# Altium schematic sheet PowerManagement.SchDoc: Power Management
size A4; Author: Grzegorz Gajoch; DocumentNumber: 3; SheetNumber: 3; SheetTotal: 16; Model: EM1; PageSetup: Record=PageOptions|CenterHorizontal=True|CenterVertical=True|PrintScale=0.52|XCorrection=1.00|YCorrection=1.00|PrintKind=1|BorderSize=5000000|LeftOffset=0|BottomOffset=0|Orientation=2|PaperLength=4200|PaperWidth=2970|Scale=100|PaperSource=7|PrintQuality=600|MediaType=1|DitherType=10|PaperKind=A3|PrintScaleMode=1
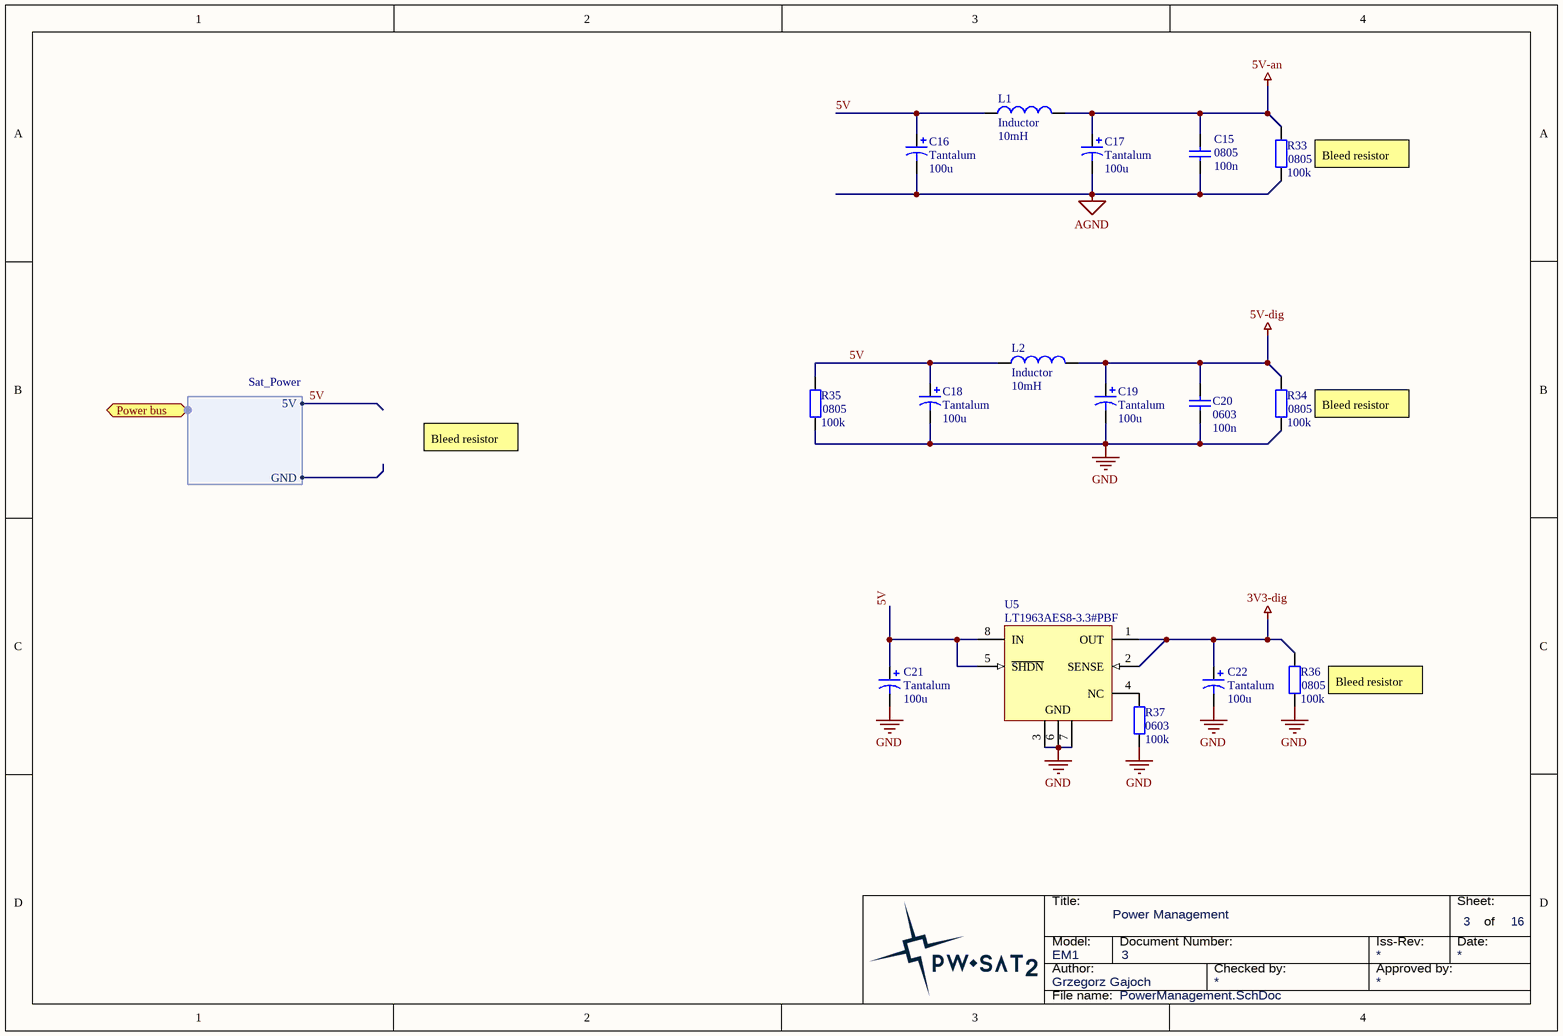
[diagram p0: PowerManagement.SchDoc]

## Parts
C15  0805  value 100n  [SMD_Capacitor_0805]
C16  Tantalum  value 100u  [Tantalum_cap_D]
C17  Tantalum  value 100u  [Tantalum_cap_D]
C18  Tantalum  value 100u  [Tantalum_cap_D]
C19  Tantalum  value 100u  [Tantalum_cap_D]
C20  0603  value 100n  [SMD_Capacitor_0603]
C21  Tantalum  value 100u  [Tantalum_cap_D]
C22  Tantalum  value 100u  [Tantalum_cap_D]
L1  Inductor  value 10mH  [SMD_Capacitor_0805]
L2  Inductor  value 10mH  [SMD_Capacitor_0805]
R33  0805  value 100k  [SMD_Resistor_0805]
R34  0805  value 100k  [SMD_Resistor_0805]
R35  0805  value 100k  [SMD_Resistor_0805]
R36  0805  value 100k  [SMD_Resistor_0805]
R37  0603  value 100k  [SMD_Resistor_0603]
U5  LT1963AES8-3.3#PBF  [LT-S8-8_N]

## Ports
Power bus (harness Sat_Power)

## Harnesses
Sat_Power: 5V, GND

## Nets
3V3-dig: C22.1 R36.2 U5.1(OUT) U5.2(SENSE)
5V-an: C15.2 C17.1 L1.2 R33.2
5V-dig: C19.1 C20.2 L2.2 R34.2
AGND: C15.1 C16.2 C17.2 R33.1
GND: C18.2 C19.2 C20.1 C21.2 C22.2 R34.1 R35.1 R36.1 R37.1 U5.3(GND) U5.6(GND) U5.7(GND)
5V: C16.1 C18.1 C21.1 L1.1 L2.1 R35.2 U5.5(~{SHDN}) U5.8(IN) ; port Power bus.5V
NetR37_2: R37.2 U5.4(NC)

## Notes on the sheet
- (near R33) Bleed resistor
- Bleed resistor
- (near R34) Bleed resistor
- (near R36) Bleed resistor
- Title:
- Sheet:
- of
- Author:
- Model:
- Document Number:
- Checked by:
- Iss-Rev:
- Approved by:
- Date:
- File name:

## Library data of the parts
C15 C20 = Cap: Capacitor; Published: 8-Jun-2000; LatestRevisionDate: 17-Jul-2002; LatestRevisionNote: Re-released for DXP Platform.; PackageReference: RAD-0.3; Publisher: Altium Limited; PackageDescription: Radial Cap, Thru-Hole; 2 Leads; 0.3 in Pin Spacing
C16-C19 C21 C22 = Cap Pol1: Polarized Capacitor (Radial); Published: 8-Jun-2000; LatestRevisionDate: 17-Jul-2002; LatestRevisionNote: Re-released for DXP Platform.; PackageReference: RB7.6-15; Publisher: Altium Limited; PackageDescription: Polarized Capacitor (Radial); 2 Leads
L1 L2 = Inductor: Code_IEC: 1005; Published: 8-Jun-2000; LatestRevisionDate: 29-May-2009; LatestRevisionNote: IPC-7351 Footprint Added.; PackageReference: 0402-A; Publisher: Altium Limited; PackageDescription: Chip Inductor; Code_JEITA: 0402
R33-R37 = Res2: Resistor; Published: 8-Jun-2000; LatestRevisionDate: 17-Jul-2002; LatestRevisionNote: Re-released for DXP Platform.; PackageReference: AXIAL-0.4; Publisher: Altium Limited; PackageDescription: Axial Device, Thru-Hole; 2 Leads; 0.4 in Pin Spacing
U5 = LT1963AES8-3.3#PBF: 1.5 A, Low Noise, Fast Transient Response LDO Regulator, 2.1 to 20 V Vin, 3.3 V Vout, 8-pin SOIC (S8-8), -40 to 125 degC, Pb-Free; Manufacturer: Linear Technology; Discrete Pass Element: no; Dropout Voltage(V): 0.34; Iout(mA): 1500; Isupply(mA): 1; Noise(uV): 40; Output Voltage: 3.3 V; PSRR(dB): 63; Shutdown Current(uA): 0.01; Vin Max(V): 20; Vin Min(V): 2.1; DatasheetVersion: Rev. E; PackageVersion: Rev. G, 03/2012; PackageReference: S8-8; PackageDescription: 8-Pin Plastic Small Outline (Narrow .150 Inch), Body 4.9 x 3.9 mm, Pitch 1.27 mm; Supplier 1: Digi-Key; Supplier Part Number 1: LT1963AES8-3.3#PBF-ND; Supplier 2: Farnell; Supplier Part Number 2: 1273628; Supplier 3: Newark; Supplier Part Number 3: 57M7476; Number of Outputs: 1; RoHS: TRUE; Mounting Technology: Surface Mount; PartNumber: LT1963AES8-3.3#PBF; ComponentLink1Description: Manufacturer URL; ComponentLink1URL: http://www.linear.com/; ComponentLink2Description: Datasheet; ComponentLink2URL: http://cds.linear.com/docs/en/datasheet/1963afe.pdf; ComponentLink3Description: Package Specification; ComponentLink3URL: http://cds.linear.com/docs/en/packaging/05081610_G_SO8.pdf